# EAGLE schematic SchematArduinoNanoEagle (EAGLE 6.3)
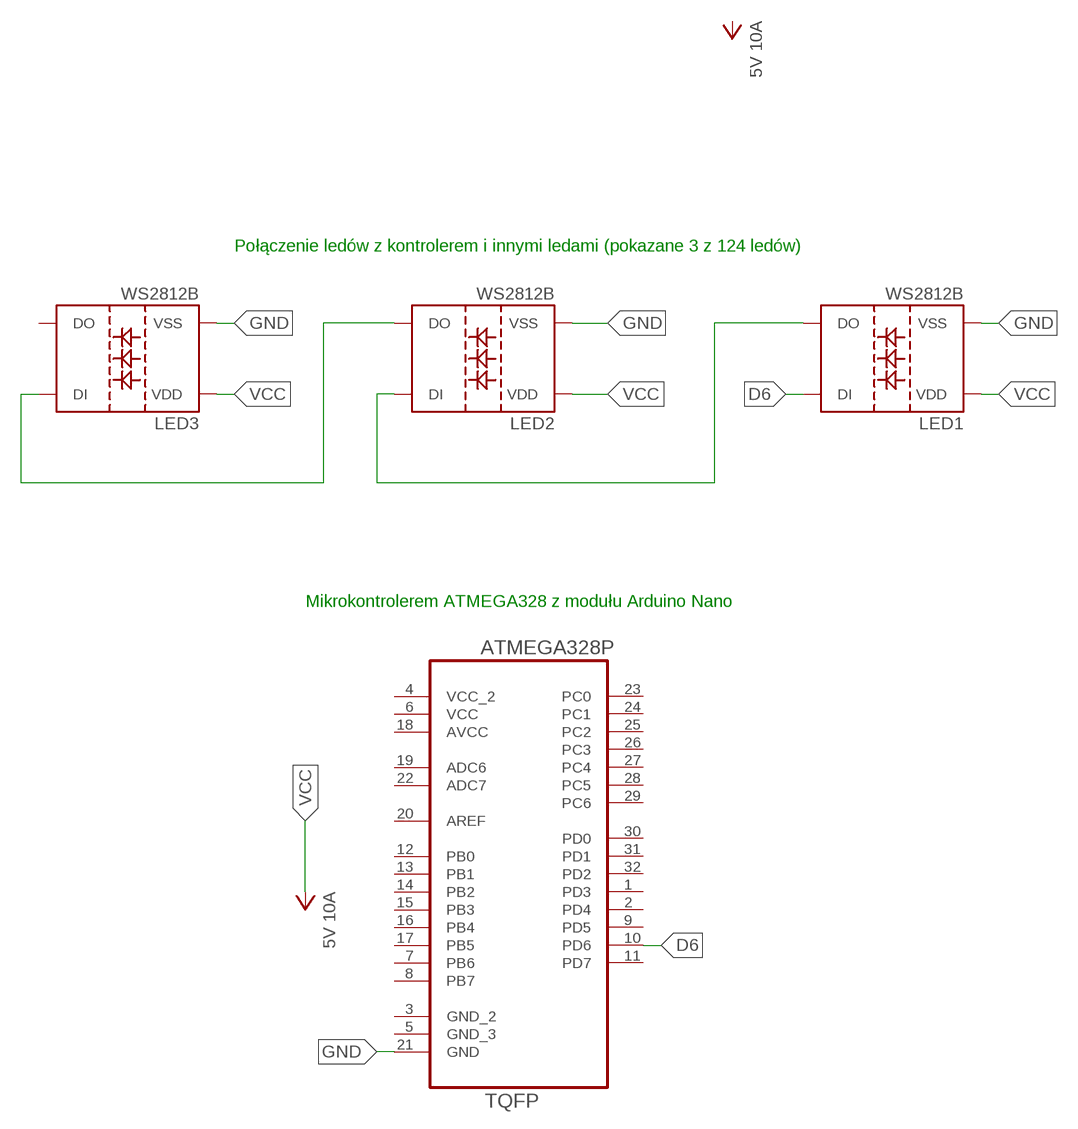
[diagram p0: schematic, sheet 1]

## Parts
LED1  WS2812B  [WS2812B]
LED2  WS2812B  [WS2812B]
LED3  WS2812B  [WS2812B]
U1  ATMEGA328P-AU  [QFP80P900X900X120-32N]

## Nets
D6: LED1.4(DI) U1.10(PD6)
GND: LED1.3(VSS) LED2.3(VSS) LED3.3(VSS) U1.21(GND)
N$1: LED1.2(DO) LED2.4(DI)
N$2: LED2.2(DO) LED3.4(DI)
VCC: LED1.1(VDD) LED2.1(VDD) LED3.1(VDD) ; supply symbol labelled 5V 10A
Unconnected: LED3.2(DO) U1.1(PD3) U1.2(PD4) U1.3(GND_2) U1.5(GND_3) U1.7(PB6) U1.8(PB7) U1.9(PD5) U1.11(PD7) U1.12(PB0) U1.13(PB1) U1.14(PB2) U1.15(PB3) U1.16(PB4) U1.17(PB5) U1.19(ADC6) U1.20(AREF) U1.22(ADC7) U1.23(PC0) U1.24(PC1) U1.25(PC2) U1.26(PC3) U1.27(PC4) U1.28(PC5) U1.29(PC6) U1.30(PD0) U1.31(PD1) U1.32(PD2)

## Notes on the sheet
- Połączenie ledów z kontrolerem i innymi ledami (pokazane 3 z 124 ledów)
- Mikrokontrolerem ATMEGA328 z modułu Arduino Nano

## Power pins joined to a net without a drawn wire
AVCC: U1.18(AVCC)
VCC: U1.6(VCC)
VCC_2: U1.4(VCC_2)

## Library data of the parts
LED1-LED3 = WS2812:WS2812B
U1 = Ava:ATMEGA328P-AU; DESCRIPTION: 8-bit Microcontroller with In-System Programmable Flash; MPN: ATMEGA328P-AU; OC_FARNELL: 1715486; OC_NEWARK: 14R4631; PACKAGE: TQFP-32; SUPPLIER: Atmel